# EAGLE design lauflicht (EAGLE 4.15)
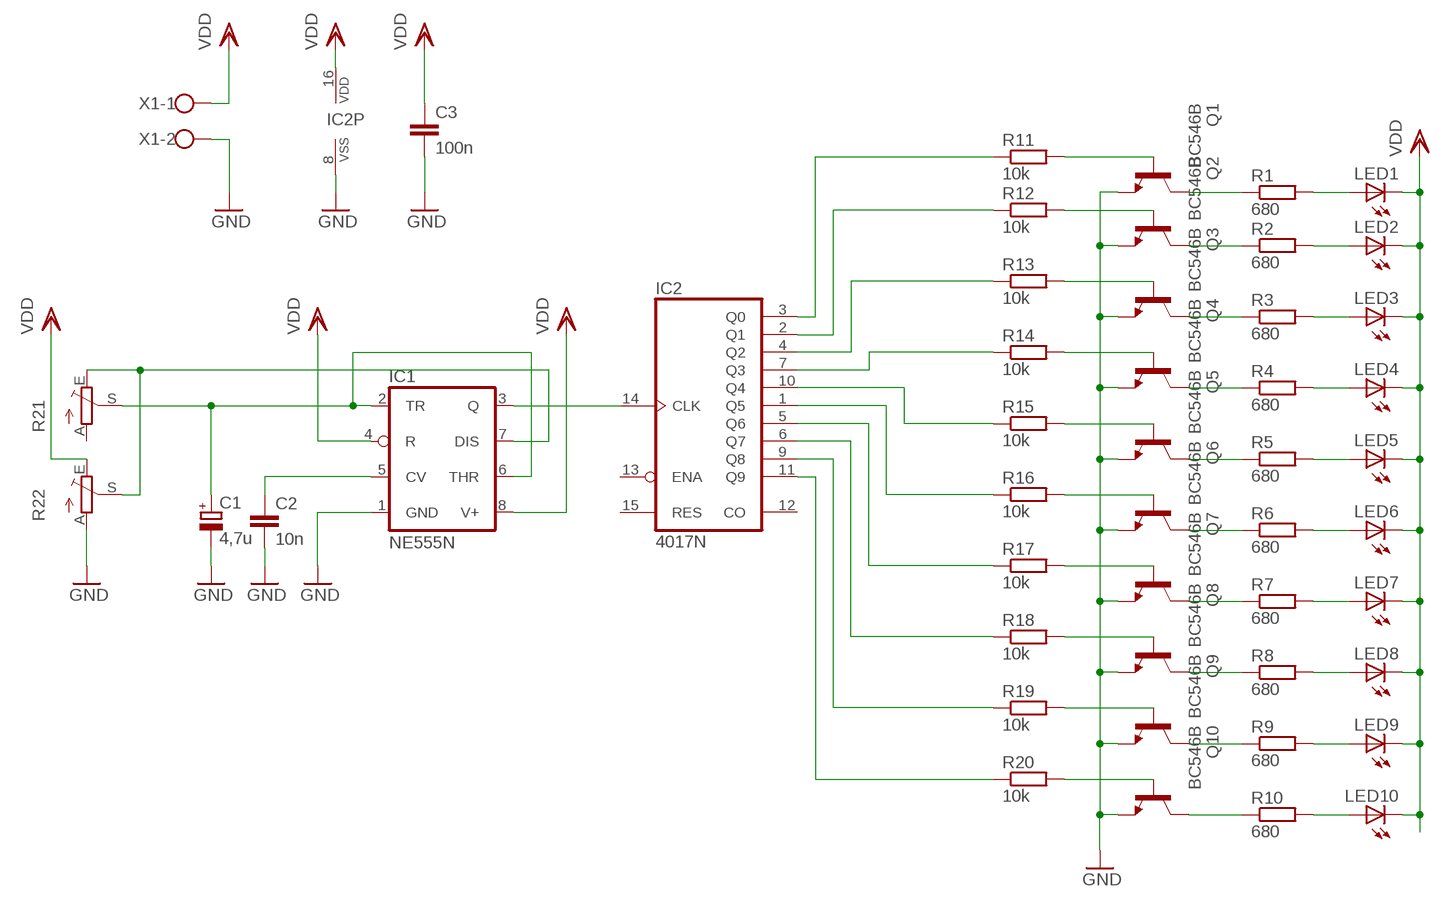
[diagram p0: schematic, sheet 1]

## Parts
C1  4,7u  CPOL-EUE2.5-7  [E2,5-7]
C2  10n  C-EU025-030X050  [C025-030X050]
C3  100n  C-EU025-030X050  [C025-030X050]
IC1  NE555N  [DIL08]
IC2  4017N  [DIL16]
LED1  LED3MM  [LED3MM]
LED2  LED3MM  [LED3MM]
LED3  LED3MM  [LED3MM]
LED4  LED3MM  [LED3MM]
LED5  LED3MM  [LED3MM]
LED6  LED3MM  [LED3MM]
LED7  LED3MM  [LED3MM]
LED8  LED3MM  [LED3MM]
LED9  LED3MM  [LED3MM]
LED10  LED3MM  [LED3MM]
Q1  BC546B  [TO92-EBC]
Q2  BC546B  [TO92-EBC]
Q3  BC546B  [TO92-EBC]
Q4  BC546B  [TO92-EBC]
Q5  BC546B  [TO92-EBC]
Q6  BC546B  [TO92-EBC]
Q7  BC546B  [TO92-EBC]
Q8  BC546B  [TO92-EBC]
Q9  BC546B  [TO92-EBC]
Q10  BC546B  [TO92-EBC]
R1  680  R-EU_0309/10  [0309/10]
R2  680  R-EU_0309/10  [0309/10]
R3  680  R-EU_0309/10  [0309/10]
R4  680  R-EU_0309/10  [0309/10]
R5  680  R-EU_0309/10  [0309/10]
R6  680  R-EU_0309/10  [0309/10]
R7  680  R-EU_0309/10  [0309/10]
R8  680  R-EU_0309/10  [0309/10]
R9  680  R-EU_0309/10  [0309/10]
R10  680  R-EU_0309/10  [0309/10]
R11  10k  R-EU_0309/10  [0309/10]
R12  10k  R-EU_0309/10  [0309/10]
R13  10k  R-EU_0309/10  [0309/10]
R14  10k  R-EU_0309/10  [0309/10]
R15  10k  R-EU_0309/10  [0309/10]
R16  10k  R-EU_0309/10  [0309/10]
R17  10k  R-EU_0309/10  [0309/10]
R18  10k  R-EU_0309/10  [0309/10]
R19  10k  R-EU_0309/10  [0309/10]
R20  10k  R-EU_0309/10  [0309/10]
R21  TRIM_EU-PT10  [PT-10]
R22  TRIM_EU-PT10  [PT-10]
X1  W237-102  [W237-102]

## Nets
GND: C1.- C2.2 C3.2 IC1.1(GND) IC2.8(VSS) Q1.E Q2.E Q3.E Q4.E Q5.E Q6.E Q7.E Q8.E Q9.E Q10.E R22.A X1.2
N$1: Q1.B R11.2
N$2: Q2.B R12.2
N$3: Q3.B R13.2
N$4: Q4.B R14.2
N$5: Q5.B R15.2
N$6: Q6.B R16.2
N$7: Q1.C R1.1
N$8: Q2.C R2.1
N$9: Q3.C R3.1
N$10: Q4.C R4.1
N$11: Q5.C R5.1
N$12: Q6.C R6.1
N$13: LED1.A R1.2
N$14: LED2.A R2.2
N$15: LED3.A R3.2
N$16: LED4.A R4.2
N$17: LED5.A R5.2
N$18: LED6.A R6.2
N$19: Q7.B R17.2
N$20: Q7.C R7.1
N$21: LED7.A R7.2
N$22: Q8.B R18.2
N$23: Q8.C R8.1
N$24: LED8.A R8.2
N$25: Q9.B R19.2
N$26: Q9.C R9.1
N$27: LED9.A R9.2
N$28: Q10.B R20.2
N$29: Q10.C R10.1
N$30: LED10.A R10.2
N$31: IC2.3(Q0) R11.1
N$32: IC2.2(Q1) R12.1
N$33: IC2.4(Q2) R13.1
N$34: IC2.7(Q3) R14.1
N$35: IC2.11(Q9) R20.1
N$36: IC2.9(Q8) R19.1
N$37: IC2.6(Q7) R18.1
N$38: IC2.5(Q6) R17.1
N$39: IC2.1(Q5) R16.1
N$40: IC2.10(Q4) R15.1
N$43: C1.+ IC1.2(TR) IC1.6(THR) R21.S
N$44: IC1.3(Q) IC2.14(CLK)
N$45: C2.1 IC1.5(CV)
N$46: IC1.7(DIS) R21.E R22.S
VDD: C3.1 IC1.4(R) IC1.8(V+) IC2.16(VDD) LED1.K(C) LED2.K(C) LED3.K(C) LED4.K(C) LED5.K(C) LED6.K(C) LED7.K(C) LED8.K(C) LED9.K(C) LED10.K(C) R22.E X1.1
Unconnected: IC2.12(CO) IC2.13(ENA) IC2.15(RES) R21.A

## Library data of the parts
C1 = rcl:CPOL-EU: POLARIZED CAPACITOR, European symbol
C2 C3 = rcl:C-EU: CAPACITOR, European symbol
IC1 = linear:*555: TIMER
IC2 = 40xx:4017: COUNTER/DIVIDER
LED1-LED10 = led:LED: LED OSRAM: - CHIPLED LG R971, LG N971, LY N971, LG Q971, LY Q971, LO R971, LY R971 LH N974, LH R974 LS Q976, LO Q976, LY Q976 LO Q996 - Hyper CHIPLED LW Q18S LB Q993, LB Q99A, LB R99A - SideLED LS A670, LO A670, LY A670, LG A670, LP A670 LB A673, LV A673, LT A673, LW A673 LH A674 LY A675 LS A676, LA A676, LO A676, LY A676, LW A676 LS A679, LY A679, LG A679 - Hyper Micro SIDELED® LS Y876, LA Y876, LO Y876, LY Y876 LT Y87S - SmartLED LW L88C, LW L88S LB L89C, LB L89S, LG L890 LS L89K, LO L89K, LY L89K LS L896, LA L896, LO L896, LY L896 - TOPLED LS T670, LO T670, LY T670, LG T670, LP T670 LSG T670, LSP T670, LSY T670, LOP T670, LYG T670 LG T671, LOG T671, LSG T671 LB T673, LV T673, LT T673, LW T673 LH T674 LS T676, LA T676, LO T676, LY T676, LB T676, LH T676, LSB T676, LW T676 LB T67C, LV T67C, LT T67C, LS T67K, LO T67K, LY T67K, LW E67C LS E67B, LA E67B, LO E67B, LY E67B, LB E67C, LV E67C, LT E67C LW T67C LS T679, LY T679, LG T679 LS T770, LO T770, LY T770, LG T770, LP T770 LB T773, LV T773, LT T773, LW T773 LH T774 LS E675, LA E675, LY E675, LS T675 LS T776, LA T776, LO T776, LY T776, LB T776 LHGB T686 LT T68C, LB T68C - Hyper Mini TOPLED® LB M676 - Mini TOPLED Santana® LG M470 LS M47K, LO M47K, LY M47K Source: http://www.osram.convergy.de/
Q1-Q10 = transistor-npn:BC546*: NPN Transistor
R1-R20 = rcl:R-EU_: RESISTOR, European symbol
R21 R22 = pot:TRIM_EU-: POTENTIOMETER
X1 = con-wago-500:W237-102: WAGO SCREW CLAMP

## Board
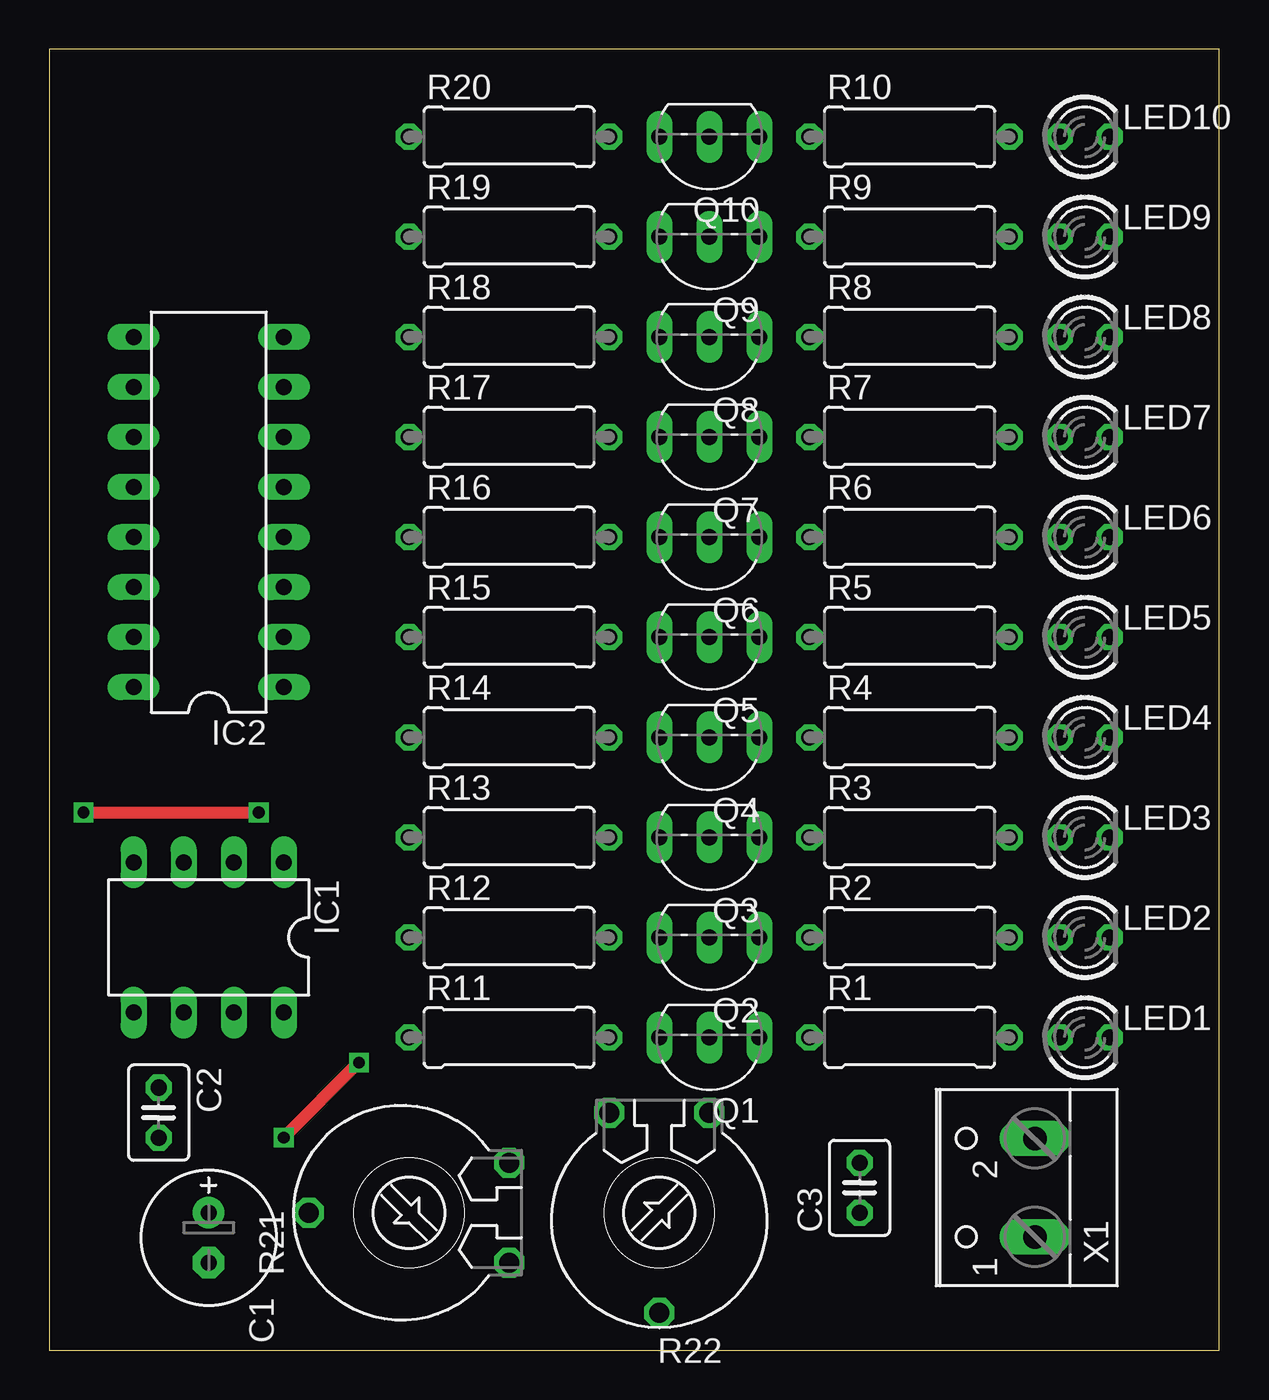
[diagram p1: board, top side]
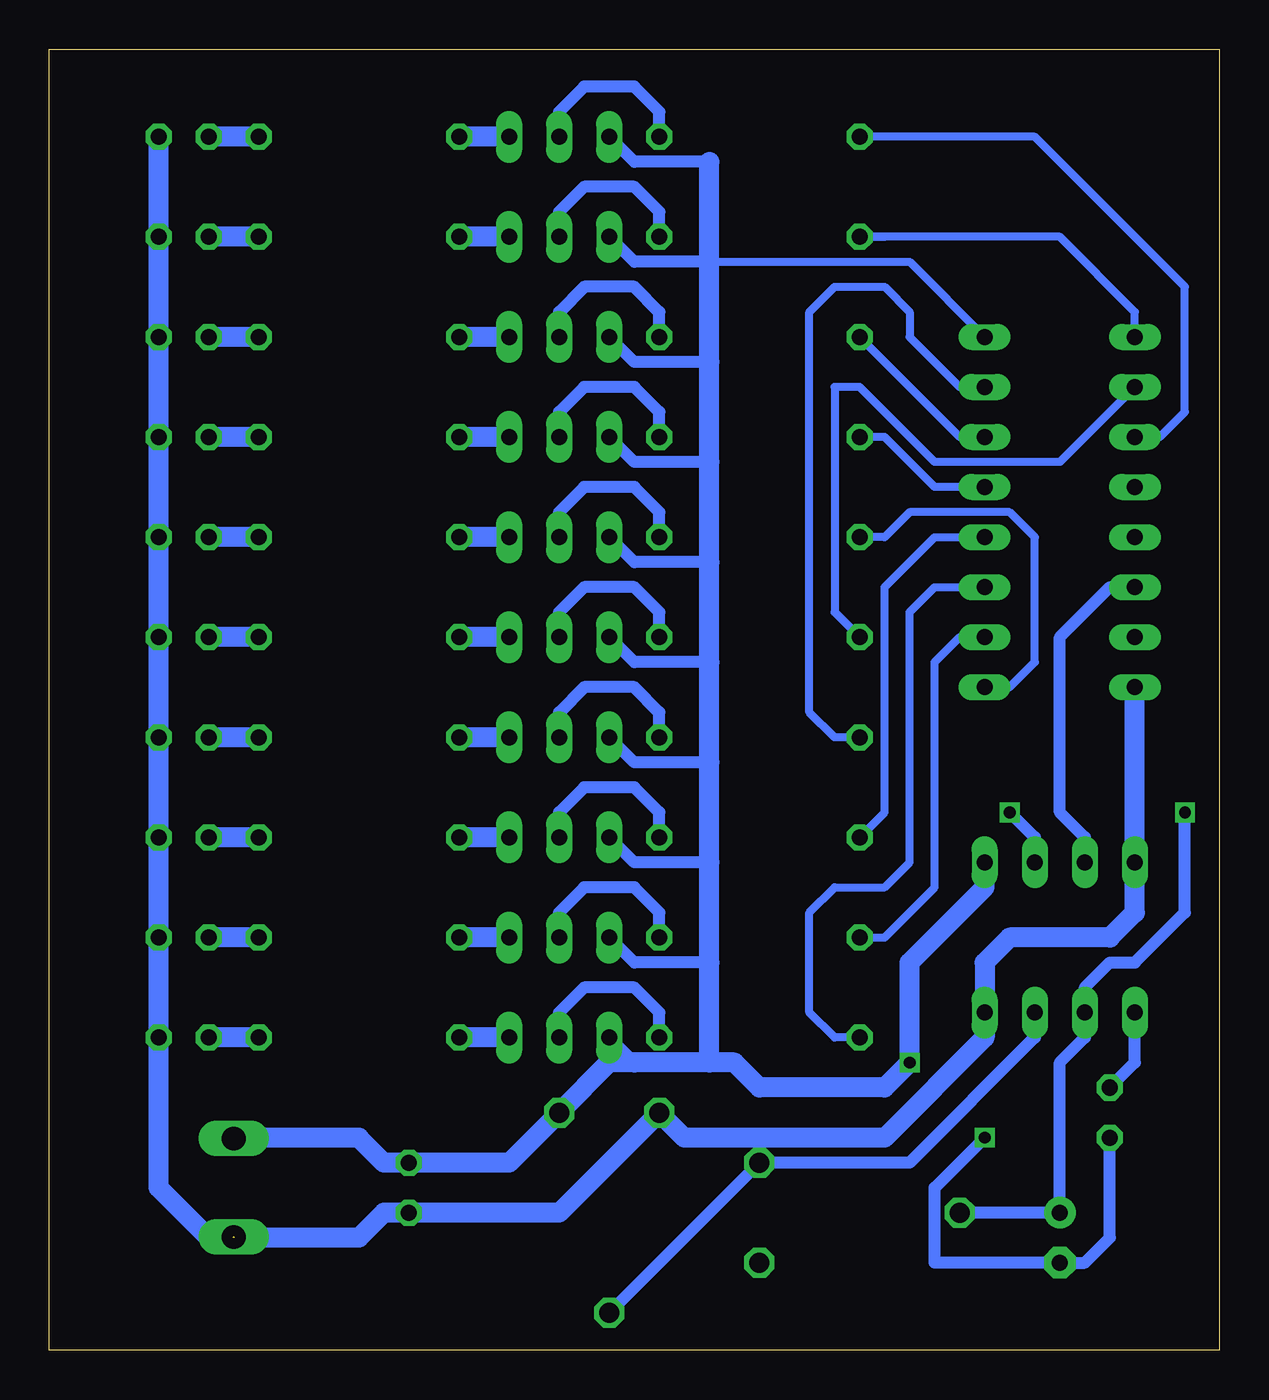
[diagram p2: board, bottom side, seen from below]

Size 59.36 x 66.03 mm. Coordinates in mm from the lower left corner, seen from the top.
Outline: 0,0 59.36,0 59.36,66.03 0,66.03 0,0
Copper layers (1*16): Top 0.035mm / dielectric 1.5mm / Bottom 0.035mm
Design rules "default": minimum track width 10mil, minimum drill 24mil, track to track 8mil, track to pad 8mil, pad to pad 8mil, via to via 8mil, smd to smd 8mil, copper to edge 40mil, drill to drill 8mil, minimum pad ring 10mil, minimum via ring 8mil, stop-mask expansion 4mil, vias tented up to drill 0mil, thermal gap 10mil

### Footprints (pad centres in the part's own frame; a part is rotated, then mirrored left to right if it is on the bottom)
E2,5-7 = drill 0.813 pad 1.6 round: + -1.27,0 | drill 0.813 pad 1.6 octagon: - 1.27,0
C025-030X050 = drill 0.813 octagon: 1 -1.27,0; 2 1.27,0
DIL08 = drill 0.813 long: 1 -3.81,-3.81; 2 -1.27,-3.81; 3 1.27,-3.81; 4 3.81,-3.81; 5 3.81,3.81; 6 1.27,3.81; 7 -1.27,3.81; 8 -3.81,3.81
DIL16 = drill 0.813 long: 1 -8.89,-3.81; 2 -6.35,-3.81; 3 -3.81,-3.81; 4 -1.27,-3.81; 5 1.27,-3.81; 6 3.81,-3.81; 7 6.35,-3.81; 8 8.89,-3.81; 9 8.89,3.81; 10 6.35,3.81; 11 3.81,3.81; 12 1.27,3.81; 13 -1.27,3.81; 14 -3.81,3.81; 15 -6.35,3.81; 16 -8.89,3.81
LED3MM = drill 0.813 octagon: A -1.27,0; K 1.27,0
TO92-EBC = drill 0.813 long: B 0,-1.27; C -2.54,-1.27; E 2.54,-1.27
0309/10 = drill 0.813 octagon: 1 -5.08,0; 2 5.08,0
PT-10 = drill 1.016 octagon: A -2.54,-5.08; E 2.54,-5.08; S 0,5.08
W237-102 = drill 1.194 long: 1 -2.5,-1.27; 2 2.5,-1.27

### Placement (x,y rotation side)
C1  8.09,5.71 270 top
C2  5.55,12.06 270 top
C3  41.11,8.25 90 top
IC1  8.09,20.95 180 top
IC2  8.09,42.54 90 top
LED1  52.54,15.87 0 top
LED2  52.54,20.95 0 top
LED3  52.54,26.03 0 top
LED4  52.54,31.11 0 top
LED5  52.54,36.19 0 top
LED6  52.54,41.27 0 top
LED7  52.54,46.35 0 top
LED8  52.54,51.43 0 top
LED9  52.54,56.51 0 top
LED10  52.54,61.59 0 top
Q1  33.49,14.6 180 top
Q2  33.49,19.68 180 top
Q3  33.49,24.76 180 top
Q4  33.49,29.84 180 top
Q5  33.49,34.92 180 top
Q6  33.49,40 180 top
Q7  33.49,45.08 180 top
Q8  33.49,50.16 180 top
Q9  33.49,55.24 180 top
Q10  33.49,60.32 180 top
R1  43.65,15.87 0 top
R2  43.65,20.95 0 top
R3  43.65,26.03 0 top
R4  43.65,31.11 0 top
R5  43.65,36.19 0 top
R6  43.65,41.27 0 top
R7  43.65,46.35 0 top
R8  43.65,51.43 0 top
R9  43.65,56.51 0 top
R10  43.65,61.59 0 top
R11  23.33,15.87 0 top
R12  23.33,20.95 0 top
R13  23.33,26.03 0 top
R14  23.33,31.11 0 top
R15  23.33,36.19 0 top
R16  23.33,41.27 0 top
R17  23.33,46.35 0 top
R18  23.33,51.43 0 top
R19  23.33,56.51 0 top
R20  23.33,61.59 0 top
R21  18.25,6.98 90 top
R22  30.95,6.98 180 top
X1  48.73,8.25 90 top

### Tracks (layer width: path | path; a pad name or v marks a point on that pad's centre or on a via)
GND  (via drill 0.6)
  Top 0.61: v11.9,10.79 v15.71,14.6
  Bottom 0.406: IC2.8 15.71,55.24 25.87,55.24
  Bottom 0.61: Q8.E 29.68,50.16 25.87,50.16 | Q7.E 29.68,45.08 25.87,45.08 | Q9.E 29.68,55.24 25.87,55.24 | Q10.E 29.68,60.32 25.87,60.32 | Q6.E 29.68,40 25.87,40 | Q5.E 29.68,34.92 25.87,34.92 | Q4.E 29.68,29.84 25.87,29.84 | Q3.E 29.68,24.76 25.87,24.76 | Q2.E 29.68,19.68 25.87,19.68 | Q1.E 29.68,14.6 25.87,14.6 | C2.2 5.55,5.71 6.82,4.44 C1.- 14.44,4.44 14.44,8.25 v11.9,10.79
  Bottom 1.016: 25.87,60.32 25.87,55.24 25.87,50.16 25.87,45.08 25.87,40 25.87,34.92 25.87,29.84 25.87,24.76 25.87,19.68 25.87,14.6 | X1.2 51.27,10.79 43.65,10.79 42.38,9.52 C3.2 36.03,9.52 R22.A 30.95,14.6 29.68,14.6 24.6,14.6 23.33,13.33 16.98,13.33 v15.71,14.6 15.71,19.68 11.9,23.49 IC1.1
N$1
  Bottom 0.61: R11.2 28.41,17.14 29.68,18.41 32.22,18.41 33.49,17.14 Q1.B
N$2
  Bottom 0.61: R12.2 28.41,22.22 29.68,23.49 32.22,23.49 33.49,22.22 Q2.B
N$3
  Bottom 0.61: R13.2 28.41,27.3 29.68,28.57 32.22,28.57 33.49,27.3 Q3.B
N$4
  Bottom 0.61: R14.2 28.41,32.38 29.68,33.65 32.22,33.65 33.49,32.38 Q4.B
N$5
  Bottom 0.61: R15.2 28.41,37.46 29.68,38.73 32.22,38.73 33.49,37.46 Q5.B
N$6
  Bottom 0.61: R16.2 28.41,42.54 29.68,43.81 32.22,43.81 33.49,42.54 Q6.B
N$7
  Bottom 1.016: Q1.C R1.1
N$8
  Bottom 1.016: Q2.C R2.1
N$9
  Bottom 1.016: Q3.C R3.1
N$10
  Bottom 1.016: Q4.C R4.1
N$11
  Bottom 1.016: Q5.C R5.1
N$12
  Bottom 1.016: Q6.C R6.1
N$13
  Bottom 1.016: R1.2 LED1.A
N$14
  Bottom 1.016: R2.2 LED2.A
N$15
  Bottom 1.016: R3.2 LED3.A
N$16
  Bottom 1.016: R4.2 LED4.A
N$17
  Bottom 1.016: R5.2 LED5.A
N$18
  Bottom 1.016: R6.2 LED6.A
N$19
  Bottom 0.61: R17.2 28.41,47.62 29.68,48.89 32.22,48.89 33.49,47.62 Q7.B
N$20
  Bottom 1.016: Q7.C R7.1
N$21
  Bottom 1.016: R7.2 LED7.A
N$22
  Bottom 0.61: R18.2 28.41,52.7 29.68,53.97 32.22,53.97 33.49,52.7 Q8.B
N$23
  Bottom 1.016: Q8.C R8.1
N$24
  Bottom 1.016: R8.2 LED8.A
N$25
  Bottom 0.61: R19.2 28.41,57.78 29.68,59.05 32.22,59.05 33.49,57.78 Q9.B
N$26
  Bottom 1.016: Q9.C R9.1
N$27
  Bottom 1.016: R9.2 LED9.A
N$28
  Bottom 0.61: R20.2 28.41,62.86 29.68,64.13 32.22,64.13 33.49,62.86 Q10.B
N$29
  Bottom 1.016: Q10.C R10.1
N$30
  Bottom 1.016: R10.2 LED10.A
N$31
  Bottom 0.406: IC2.3 14.44,38.73 15.71,37.46 15.71,24.76 16.98,23.49 19.52,23.49 20.79,22.22 20.79,17.14 19.52,15.87 R11.1
N$32
  Bottom 0.406: IC2.2 13.17,36.19 14.44,34.92 14.44,23.49 16.98,20.95 R12.1
N$33
  Bottom 0.406: R13.1 16.98,27.3 16.98,38.73 14.44,41.27 IC2.4
N$34
  Bottom 0.406: IC2.7 13.17,48.89 15.71,51.43 15.71,52.7 16.98,53.97 19.52,53.97 20.79,52.7 20.79,32.38 19.52,31.11 R14.1
N$35
  Bottom 0.406: IC2.11 3.01,46.35 1.74,47.62 1.74,53.97 9.36,61.59 R20.1
N$36
  Bottom 0.406: IC2.9 4.28,52.7 8.09,56.51 R19.1 16.98,56.51
N$37
  Bottom 0.406: IC2.6 13.17,46.35 R18.1
N$38
  Bottom 0.406: IC2.5 14.44,43.81 16.98,46.35 R17.1
N$39
  Bottom 0.406: IC2.1 10.63,33.65 9.36,34.92 9.36,41.27 10.63,42.54 15.71,42.54 16.98,41.27 R16.1
N$40
  Bottom 0.406: IC2.10 8.09,45.08 14.44,45.08 18.25,48.89 19.52,48.89 19.52,37.46 R15.1
N$43  (via drill 0.6)
  Top 0.61: v1.74,27.3 v10.63,27.3
  Bottom 0.61: R21.S C1.+ 8.09,14.6 6.82,15.87 IC1.6 6.82,18.41 5.55,19.68 4.28,19.68 1.74,22.22 v1.74,27.3 | IC1.2 9.36,26.03 v10.63,27.3
N$44
  Bottom 0.61: IC2.14 5.55,38.73 8.09,36.19 8.09,27.3 6.82,26.03 IC1.3
N$45
  Bottom 0.61: C2.1 4.28,14.6 IC1.5
N$46
  Bottom 0.61: IC1.7 9.36,15.87 15.71,9.52 R21.E R22.S
VDD  (2 unrouted)
  Bottom 1.016: 49.96,5.71 43.65,5.71 42.38,6.98 C3.1 33.49,6.98 R22.E 27.14,10.79 16.98,10.79 11.9,15.87 IC1.8 11.9,19.68 10.63,20.95 5.55,20.95 4.28,22.22 IC1.4 IC2.16 | LED10.K LED9.K LED8.K LED7.K LED6.K LED5.K LED4.K LED3.K LED2.K LED1.K 53.81,8.25 51.27,5.71 50.04,5.71